# Altium schematic sheet Throughhole final schematic.SchDoc
size A; SheetNumber: 1; SheetTotal: 1
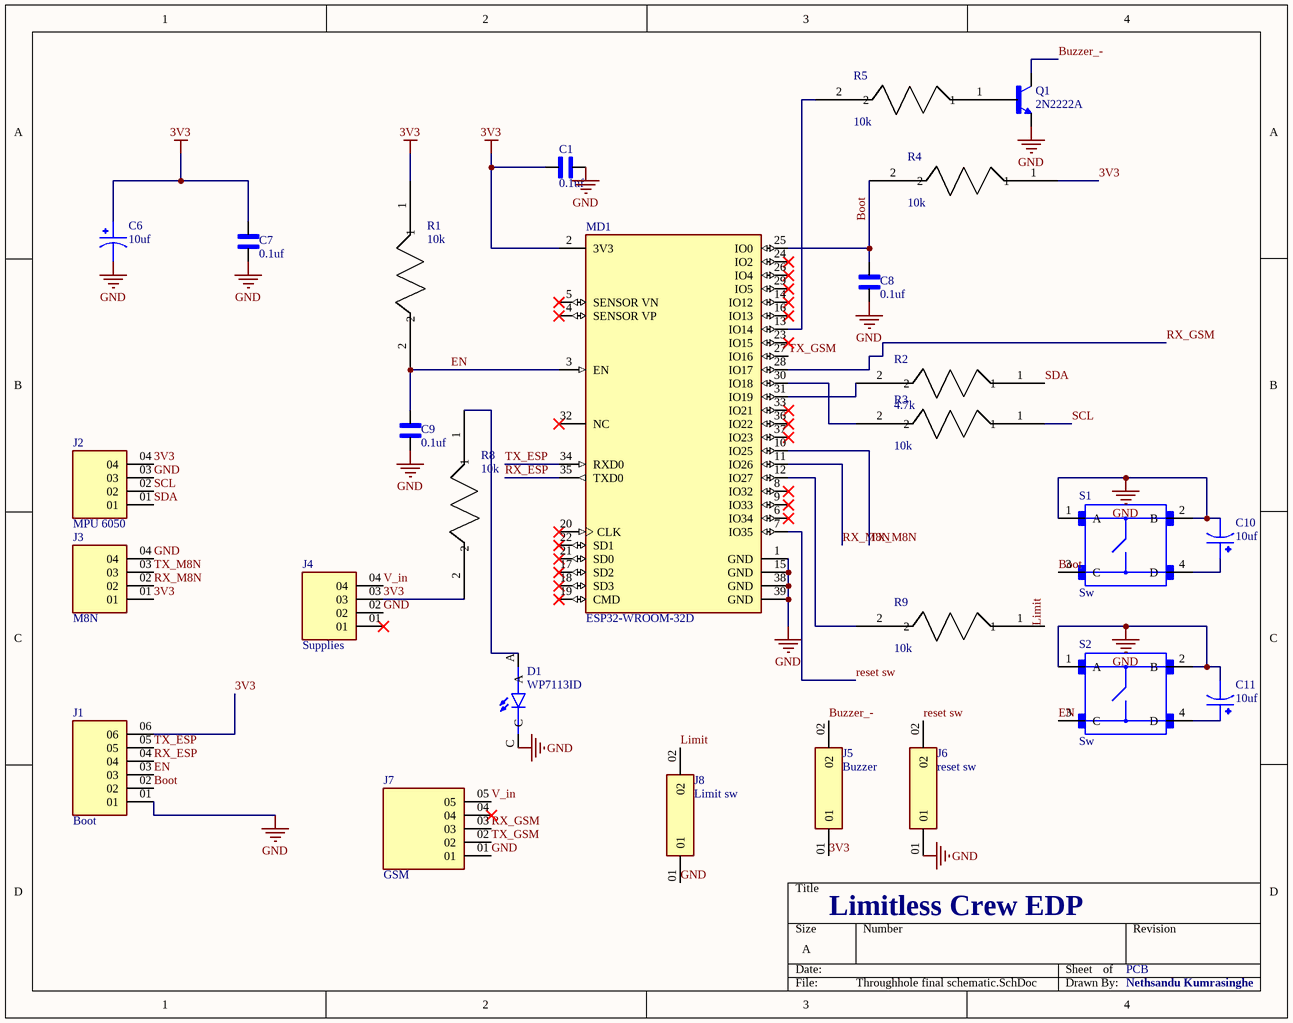
[diagram p0: Throughhole final schematic.SchDoc]

## Parts
C1  0.1uf  [CAPRB500W50L450T250H550]
C6  10uf  [CAPPRD500W60D1000H2200]
C7  0.1uf  [CAPRB500W50L450T250H550]
C8  0.1uf  [CAPRB500W50L450T250H550]
C9  0.1uf  [CAPRB500W50L450T250H550]
C10  10uf  [CAPPRD500W60D1000H2200]
C11  10uf  [CAPPRD500W60D1000H2200]
D1  WP7113ID  [LED_WP7113ID]
J1  Boot  [SAMTEC_HMTSW-106-X-X-S-X]
J2  MPU 6050  [SAMTEC_MTLW-104-X-X-S-X]
J3  M8N  [SAMTEC_MTLW-104-X-X-S-X]
J4  Supplies  [SAMTEC_MTLW-104-X-X-S-X]
J5  Buzzer  [SAMTEC_MTSW-101-X-X-D-X]
J6  reset sw  [SAMTEC_MTSW-101-X-X-D-X]
J7  GSM  [SAMTEC_MTLW-105-06-T-S-135]
J8  Limit sw  [SAMTEC_MTSW-101-X-X-D-X]
MD1  ESP32-WROOM-32D  [FP-ESP32-WROOM-32D-MFG]
Q1  2N2222A  [TO92254P470H750-3]
R1  10k  [RESAD1100W55L680D260]
R2  4.7k  [RESAD1100W55L680D260]
R3  10k  [RESAD1100W55L680D260]
R4  10k  [RESAD1100W55L680D260]
R5  10k  [RESAD1100W55L680D260]
R8  10k  [RESAD1100W55L680D260]
R9  10k  [RESAD1100W55L680D260]
S1  Sw  [SW_TS-1109]
S2  Sw  [SW_TS-1109]

## Nets
3V3: C1.1 C6.1 C7.2 J1.06 J2.04 J3.01 J4.03 J5.01 MD1.2(3V3) R1.1 R4.1 R8.2
GND: C1.2 C6.2 C7.1 C8.2 C9.1 C10.2 C11.2 D1.C J1.01 J2.03 J3.04 J4.02 J6.01 J7.01 J8.01 MD1.1(GND) MD1.15(GND) MD1.38(GND) MD1.39(GND) Q1.1(E) S1.1(A) S1.2(B) S2.1(A) S2.2(B)
Boot: C8.1 J1.02 MD1.25(IO0) R4.2 S1.3(C)
Buzzer_-: J5.02 Q1.3(C)
EN: C9.2 J1.03 MD1.3(EN) R1.2 S2.3(C)
Limit: J8.02 R9.1
reset sw: J6.02 MD1.7(IO35)
RX_ESP: J1.04 MD1.35(TXD0)
RX_GSM: J7.03 MD1.28(IO17)
RX_M8N: J3.02 MD1.11(IO26)
SCL: J2.02 R3.1
SDA: J2.01 R2.1
TX_ESP: J1.05 MD1.34(RXD0)
TX_GSM: J7.02 MD1.27(IO16)
TX_M8N: J3.03 MD1.10(IO25)
V_in: J4.04 J7.05
NetC10_1: C10.1 S1.4(D)
NetC11_1: C11.1 S2.4(D)
NetD1_A: D1.A R8.1
NetMD1_12: MD1.12(IO27) R9.2
NetMD1_13: MD1.13(IO14) R5.2
NetMD1_30: MD1.30(IO18) R3.2
NetMD1_31: MD1.31(IO19) R2.2
NetQ1_2: Q1.2(B) R5.1

Not connected (* = marked no-connect by the designer): J4 01*; J7 04*; MD1 4(SENSOR_VP)* 5(SENSOR_VN)* 6(IO34)* 8(IO32)* 9(IO33)* 14(IO12)* 16(IO13)* 17(SD2)* 18(SD3)* 19(CMD)* 20(CLK)* 21(SD0)* 22(SD1)* 23(IO15)* 24(IO2)* 26(IO4)* 29(IO5)* 32(NC)* 33(IO21)* 36(IO22)* 37(IO23)*

## Notes on the sheet
- Limitless Crew EDP
- PCB
- Nethsandu Kumrasinghe

## Library data of the parts
C1 C7-C9 = 0.1uf: CAP CER 0.1UF 100V X7R RADIAL; MF: TDK; MP: FK24X7R2A104KN000; SnapEDA_Link: https://www.snapeda.com/parts/FK24X7R2A104KN000/TDK/view-part/?ref=snap; Package: None; Value: *; Check_prices: https://www.snapeda.com/parts/FK24X7R2A104KN000/TDK/view-part/?ref=eda
C6 C10 C11 = 10uf: CAP ALUM 10UF 20% 350V RADIAL; MF: EPCOS; MP: B43890A4106M000; SnapEDA_Link: https://www.snapeda.com/parts/B43890A4106M000/EPCOS/view-part/?ref=snap; Package: None; Value: *; Check_prices: https://www.snapeda.com/parts/B43890A4106M000/EPCOS/view-part/?ref=eda
D1 = WP7113ID: Red 617nm LED Indication - Discrete 2V Radial; MF: Kingbright; Price: None; MP: WP7113ID; Package: Radial Kingbright; Check_prices: https://www.snapeda.com/parts/WP7113ID/Kingbright/view-part/?ref=eda; Purchase-URL: https://pricing.snapeda.com/search/part/WP7113ID/?ref=eda; Availability: In Stock; Value: *; SnapEDA_Link: https://www.snapeda.com/parts/WP7113ID/Kingbright/view-part/?ref=snap
J1 = connector: .100 High-Temp Variable Post Height Terminal Strip; MF: SAMTEC; MP: HMTSW-106-07-T-S-200; SnapEDA_Link: https://www.snapeda.com/parts/HMTSW-106-07-T-S-200/Samtec/view-part/?ref=snap; Package: None; Value: *; Check_prices: https://www.snapeda.com/parts/HMTSW-106-07-T-S-200/Samtec/view-part/?ref=eda
J2-J4 = MTLW-104-X-X-S-X: MF: {'manufacturer': u'Samtec Inc.'}; Package: None; Price: None; Value: *; MP: MTLW-104-X-X-S-X; Availability: Unavailable
J5 J6 J8 = MTSW-101-X-X-D-X: Variable Height PCB Header Strips, 0.100 pitch; MF: SAMTEC; MP: MTSW-101-09-L-D-210; SnapEDA_Link: https://www.snapeda.com/parts/MTSW-101-09-L-D-210/Samtec/view-part/?ref=snap; Package: None; Value: *; Check_prices: https://www.snapeda.com/parts/MTSW-101-09-L-D-210/Samtec/view-part/?ref=eda
J7 = MTLW-105-06-T-S-135: Package: None; Price: None; Availability: Unavailable; MP: MTLW-105-06-T-S-135; Value: *
MD1 = esp32wroom32d: WIFI MODULE 32MBITS SPI FLASH; Manufacturer: Espressif Systems; Max Supply Voltage: 3.6V; Nominal Supply Current: 500mA; Max Frequency: 2484MHz; Number Of Adc Channels: 16; Number Of Gpio: 32; Interface: I2C,SPI,UART,Ethernet,I2S,Other; Data Rate: 150Mbits/s; Min Supply Voltage: 3V; Bandwidth: 72MHz; Sensitivity: -98dBm; Octopart: https://octopart.com/esp32-wroom-32d-espressif+systems-91040050; Package: ESP32-WROOM-32D; ComponentLink2URL: https://www.espressif.com/sites/default/files/documentation/esp32-wroom-32d_esp32-wroom-32u_datasheet_en.pdf; Lead Free: Yes; Category: UNK; Mouser Description: Wi-Fi/BT BLE Module ESP32-D0WD, SPI Flash, UART, P; Device Class L1: Integrated Circuits (ICs); RoHS: TRUE; Temperature Range Low: -40°C; ComponentLink2Description: Datasheet; Digikey Description: WIFI MODULE 32MBITS SPI FLASH; Height: 3.2mm; Temperature: -40°C to +85°C; Manufacturer Part Number: ESP32-WROOM-32D; Device Class L3: Transceivers; Device Class L2: RF Semiconductors and Devices; Temperature Range High: +85°C; Automotive: No
Q1 = 2N2222A: BJT, TO-92, 40V, 600mA, NPN, 0.625W, 150Â°C; MF: Diotec Semiconductor; SnapEDA_Link: https://www.snapeda.com/parts/2N2222A/Diotec/view-part/?ref=snap; Package: TO-92 Diotec; Value: *; MP: 2N2222A; Check_prices: https://www.snapeda.com/parts/2N2222A/Diotec/view-part/?ref=eda
R1 R3-R5 R8 R9 = 10k: Fixed Resistor, Carbon Film, 0.25W, 10000ohm, 250V, 5% +/-Tol, -500,350ppm/Cel, Through Hole Mount; Manufacturer: Yageo; Manufacturer Part Number: CFR-25JR-52-10K; Power: 250mW; Rated Temperature: 70°C; Value: 10kR; Temperature Coefficient (ppm/Cel): 500; Lead Diameter: 0.55mm; Package Length: 6.3mm; Supplier: Future Electronics; Supplier Part Number: 3706249; RoHS: Yes; Category: Through-Hole Resistors; Stock: 15000; Pricing: 5000=0.0065, 15000=0.0063, 20000=0.0063, 50000=0.0061, 75000=0.006 (USD); Mounting Technology: Through Hole; Pins: 2; Package Shape: Tubular; Terminal Finish: Tin; Min Operating Temperature: -55°C; Max Operating Temperature: 155°C; Tolerance: 5%; JESD-609 Code: e3; Resistor Type: FIXED RESISTOR; Construction: Cylindrical; Package Style: AXIAL; Packaging: Tape and Reel; Technology: CARBON FILM; Termination: Wire; Working Voltage: 250V; Reach SVHC Compliant: Yes; RoHS Compliant: Yes; ComponentLink1URL: https://datasheet.ciiva.com:443/pdfs/VipMasterIC/IC/YAGO/YAGO-S-A0009358724/YAGO-S-A0009358724-1.pdf?src-supplier=IHS+Markit; ComponentLink1Description: https://datasheet.ciiva.com:443/pdfs/VipMasterIC/IC/YAGO/YAGO-S-A0009358724/YAGO-S-A0009358724-1.pdf?src-supplier=IHS+Markit; ComponentLink2URL: http://www.mouser.com/ds/2/447/Yageo%20LR_CFR_2013-595289.pdf?src-supplier=Mouser; ComponentLink2Description: http://www.mouser.com/ds/2/447/Yageo%20LR_CFR_2013-595289.pdf?src-supplier=Mouser; ComponentLink3URL: http://www.yageo.com/documents/recent/Yageo%20LR_CFR_2013.pdf?src-supplier=Digikey; ComponentLink3Description: http://www.yageo.com/documents/recent/Yageo%20LR_CFR_2013.pdf?src-supplier=Digikey; ComponentLink4URL: http://www.yageo.com/documents/recent/Yageo%20LR_CFR_2013.pdf?src-supplier=Avnet; ComponentLink4Description: http://www.yageo.com/documents/recent/Yageo%20LR_CFR_2013.pdf?src-supplier=Avnet; ComponentLink5URL: https://datasheet.octopart.com/CFR-25JR-52-10K-Yageo-datasheet-155367611.pdf?src-supplier=Newark; ComponentLink5Description: https://datasheet.octopart.com/CFR-25JR-52-10K-Yageo-datasheet-155367611.pdf?src-supplier=Newark; ComponentLink6URL: http://www.yageo.com/documents/recent/General%20Type_CFR.pdf?src-supplier=Future+Electronics; ComponentLink6Description: http://www.yageo.com/documents/recent/General%20Type_CFR.pdf?src-supplier=Future+Electronics; ComponentLink7URL: https://datasheet.octopart.com/CFR-25JR-52-10K-Yageo-datasheet-137875058.pdf?src-supplier=Future+Electronics; ComponentLink7Description: https://datasheet.octopart.com/CFR-25JR-52-10K-Yageo-datasheet-137875058.pdf?src-supplier=Future+Electronics
R2 = 4.7k: Fixed Resistor, Carbon Film, 0.25W, 4700ohm, 250V, 5% +/-Tol, -500,350ppm/Cel, Through Hole Mount; Manufacturer: Yageo; Manufacturer Part Number: CFR-25JR-52-4K7; Power: 250mW; Rated Temperature: 70°C; Value: 4.7kR; Temperature Coefficient (ppm/Cel): 500; Lead Diameter: 0.55mm; Package Length: 6.3mm; Supplier: Digikey; Supplier Part Number: 13-CFR-25JR-52-4K7CT-ND; RoHS: Yes; Category: Through-Hole Resistors; Stock: 3480; Pricing: 1=0.1, 10=0.034, 25=0.0284, 50=0.0246, 100=0.0217, 250=0.01832, 500=0.01626, 1000=0.01448 (USD); Mounting Technology: Through Hole; Pins: 2; Package Shape: Tubular; Terminal Finish: Tin; Min Operating Temperature: -55°C; Max Operating Temperature: 155°C; Tolerance: 5%; JESD-609 Code: e3; Resistor Type: FIXED RESISTOR; Construction: Cylindrical; Package Style: AXIAL; Packaging: Tape and Reel; Technology: CARBON FILM; Termination: Wire; Working Voltage: 250V; Reach SVHC Compliant: Yes; RoHS Compliant: Yes; ComponentLink1URL: https://datasheet.ciiva.com:443/pdfs/VipMasterIC/IC/YAGO/YAGO-S-A0009358724/YAGO-S-A0009358724-1.pdf?src-supplier=IHS+Markit; ComponentLink1Description: https://datasheet.ciiva.com:443/pdfs/VipMasterIC/IC/YAGO/YAGO-S-A0009358724/YAGO-S-A0009358724-1.pdf?src-supplier=IHS+Markit; ComponentLink2URL: http://www.mouser.com/ds/2/447/Yageo%20LR_CFR_2013-540723.pdf?src-supplier=Mouser; ComponentLink2Description: http://www.mouser.com/ds/2/447/Yageo%20LR_CFR_2013-540723.pdf?src-supplier=Mouser; ComponentLink3URL: http://www.yageo.com/NewPortal/yageodocoutput?fileName=/pdf/throughhole/Yageo_LR_CFR_2013.pdf&src-supplier=Digikey; ComponentLink3Description: http://www.yageo.com/NewPortal/yageodocoutput?fileName=/pdf/throughhole/Yageo_LR_CFR_2013.pdf&src-supplier=Digikey; ComponentLink4URL: http://www.yageo.com/documents/recent/Yageo%20LR_CFR_2013.pdf?src-supplier=Avnet; ComponentLink4Description: http://www.yageo.com/documents/recent/Yageo%20LR_CFR_2013.pdf?src-supplier=Avnet; ComponentLink5URL: http://www.yageo.com/documents/recent/General%20Type_CFR.pdf?src-supplier=Future+Electronics; ComponentLink5Description: http://www.yageo.com/documents/recent/General%20Type_CFR.pdf?src-supplier=Future+Electronics; ComponentLink6URL: https://datasheet.octopart.com/CFR-25JR-52-4K7-Yageo-datasheet-155367611.pdf?src-supplier=Farnell; ComponentLink6Description: https://datasheet.octopart.com/CFR-25JR-52-4K7-Yageo-datasheet-155367611.pdf?src-supplier=Farnell
S1 S2 = Sw: Heat Sink Full Brick DC/DC Converter Aluminum Top Mount; MP: TS-1109; MF: Samtec Inc.; Price: None; Availability: Unavailable; SnapEDA_Link: https://www.snapeda.com/parts/TS-1109/Samtec%20Inc./view-part/106451/?ref=snap; Value: *; Package: None